# EAGLE design DigiPC Jr (EAGLE 7.2.0)
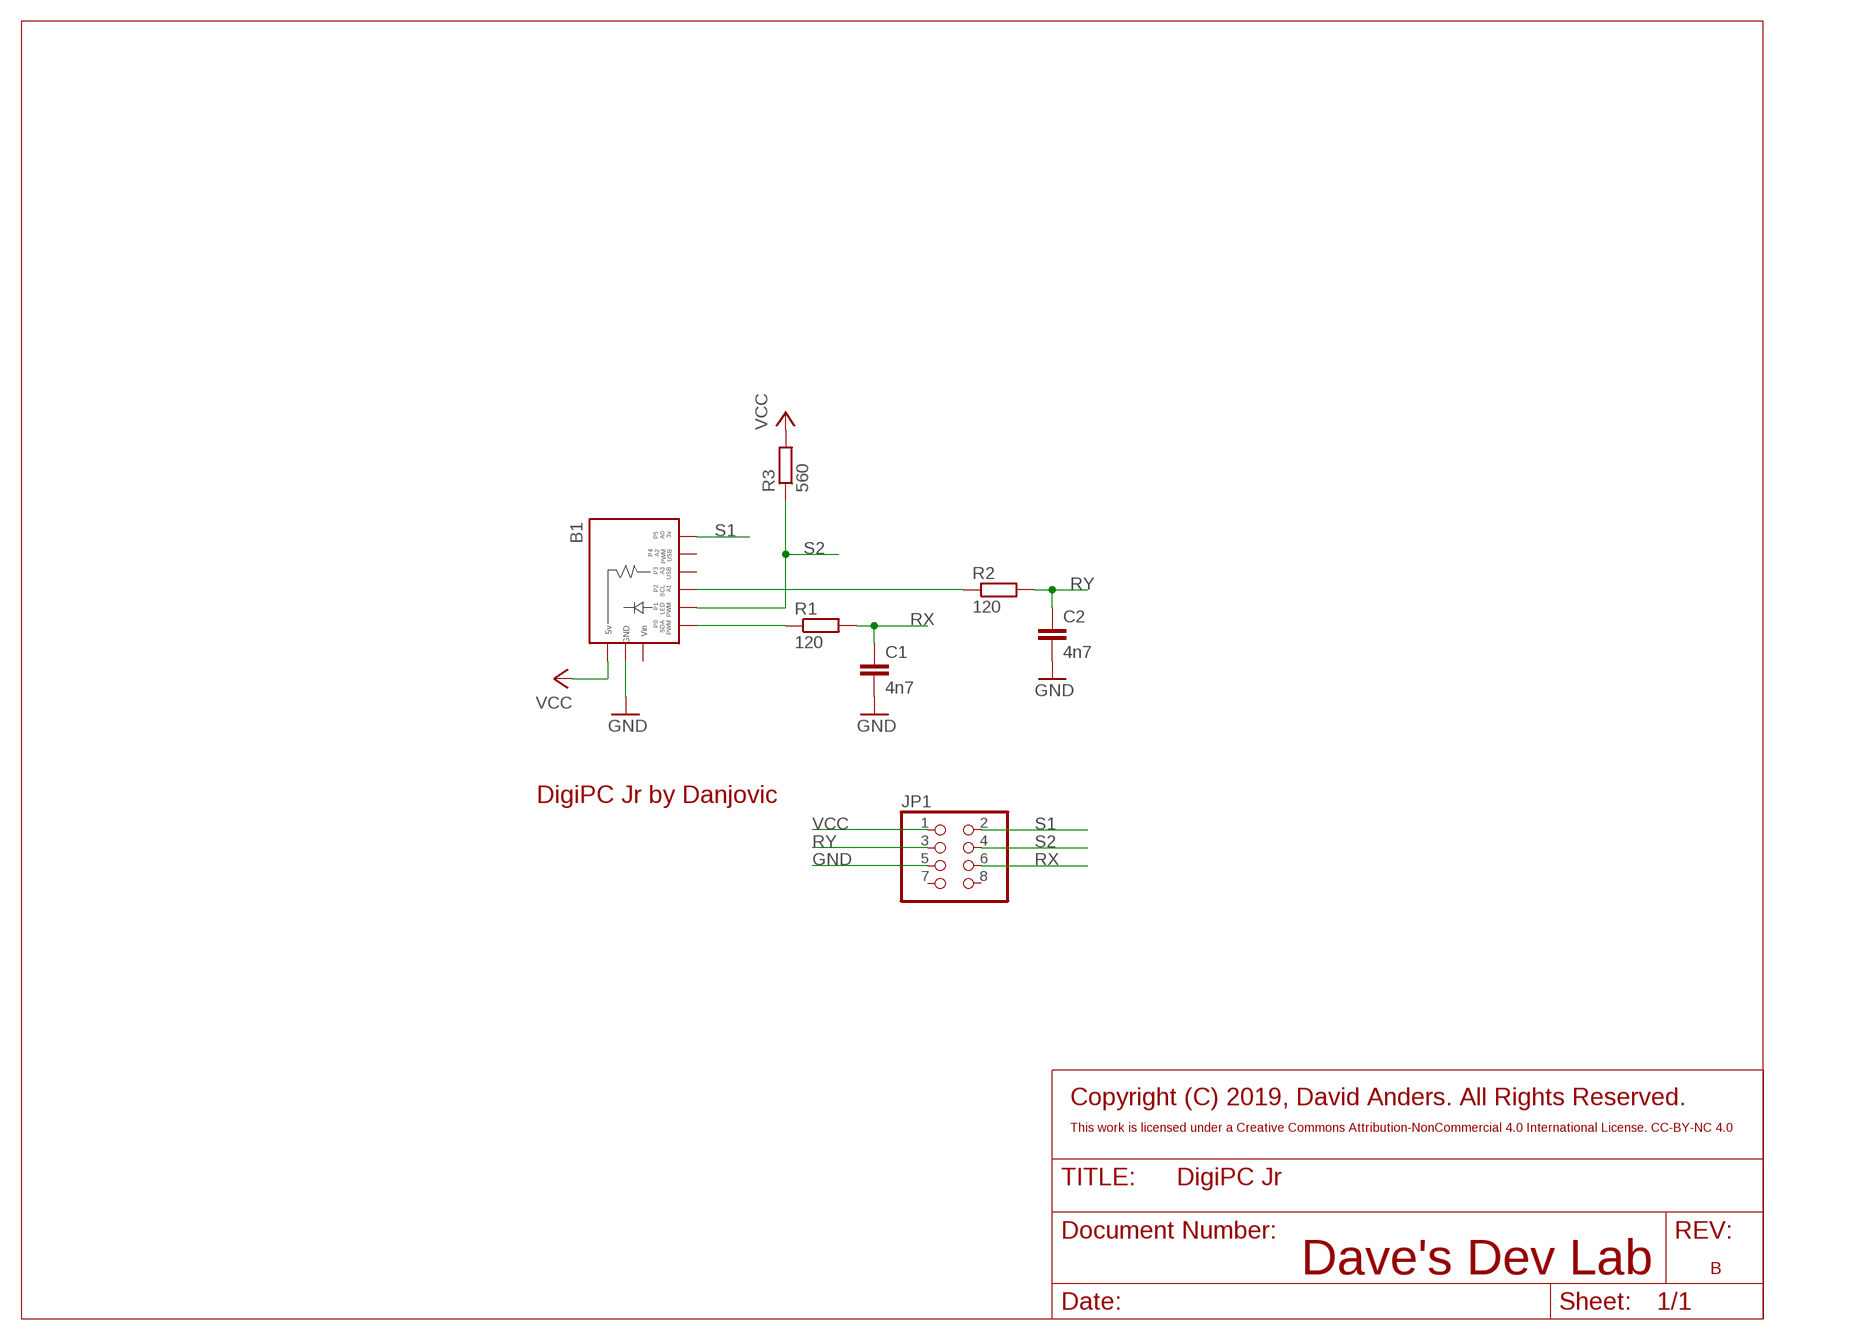
[diagram p0: schematic, sheet 1]

## Parts
B1  DIGISPARK-SOCKET  [DIGISPARK_SOCKET]
C1  4n7  C-EU050-024X044  [C050-024X044]
C2  4n7  C-EU050-024X044  [C050-024X044]
JP1  PINHD-2X4/90  [2X04/90]
R1  120  R-EU_0204/7  [0204/7]
R2  120  R-EU_0204/7  [0204/7]
R3  560  R-EU_0204/7  [0204/7]

## Nets
GND: B1.GND C1.2 C2.2 JP1.5
N$1: B1.P2 R2.1
N$2: B1.P0 R1.1
RX: C1.1 JP1.6 R1.2
RY: C2.1 JP1.3 R2.2
S1: B1.P5 JP1.2
S2: B1.P1 JP1.4 R3.1
VCC: B1.5V JP1.1 R3.2
Unconnected: B1.P3 B1.P4 JP1.7 JP1.8

## Notes on the sheet
- DigiPC Jr by Danjovic
- Copyright (C) 2019, David Anders. All Rights Reserved.
- This work is licensed under a Creative Commons Attribution-NonCommercial 4.0 International License. CC-BY-NC 4.0
- Dave's Dev Lab | B

## Power pins joined to a net without a drawn wire
VIN: B1.VIN

## Library data of the parts
B1 = Digistump:DIGISPARK: Digispark http://digistump.com/wiki/digispark
C1 C2 = rcl:C-EU: CAPACITOR, European symbol
JP1 = custom-pinhead:PINHD-2X4: PIN HEADER
R1-R3 = rcl:R-EU_: RESISTOR, European symbol

## Board
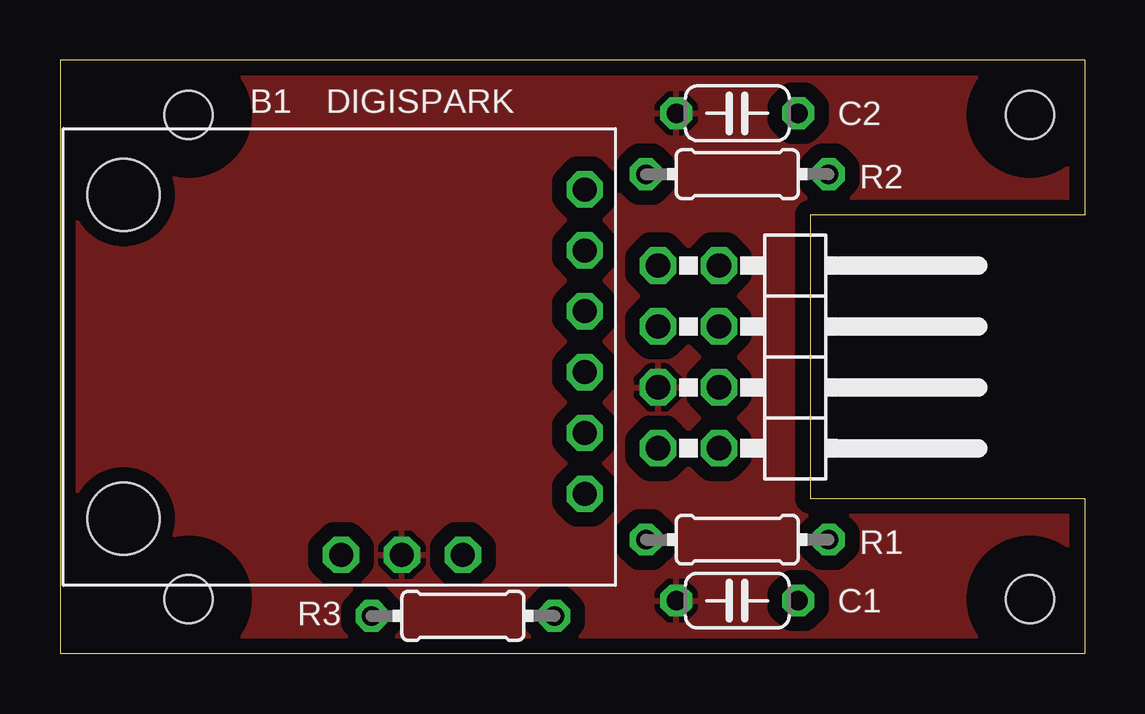
[diagram p1: board, top side]
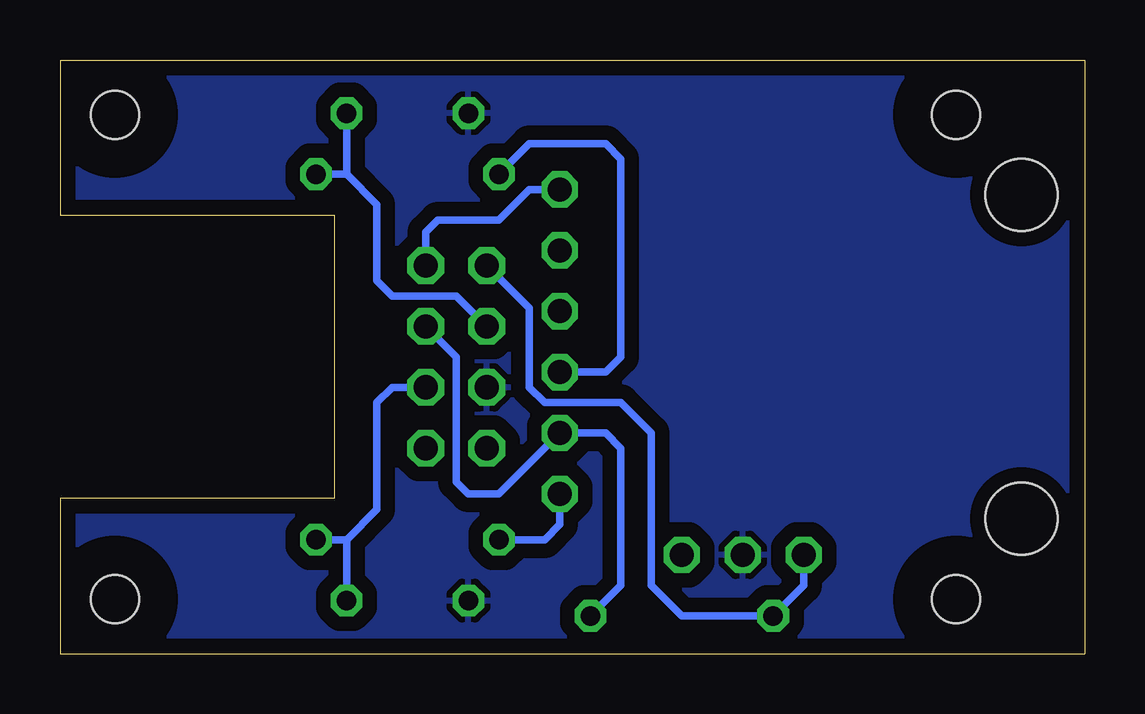
[diagram p2: board, bottom side, seen from below]

Size 42.7 x 24.77 mm. Coordinates in mm from the lower left corner, seen from the top.
Outline: 42.7,24.77 0,24.77 0,0 42.7,0 42.7,6.48 31.27,6.48 31.27,18.29 42.7,18.29 42.7,24.77
Copper layers (1*16): Top 0.035mm / dielectric 1.5mm / Bottom 0.035mm
Design rules "default *": minimum track width 8mil, minimum drill 12mil, track to track 8mil, track to pad 8mil, pad to pad 8mil, via to via 8mil, smd to smd 8mil, copper to edge 25mil, drill to drill 8mil, minimum pad ring 10mil, minimum via ring 8mil, stop-mask expansion 4mil, vias tented up to drill 0mil, thermal gap 10mil
Holes 2.01 mm at 40.41,22.48 5.36,22.48 40.41,2.29 5.36,2.29
tRestrict: area 38.4,20.5 to 42.4,24.5; area 3.4,20.5 to 7.4,24.5; area 38.4,0.3 to 42.4,4.3; area 3.4,0.3 to 7.4,4.3
bRestrict: area 38.4,20.5 to 42.4,24.5; area 3.4,20.5 to 7.4,24.5; area 38.4,0.3 to 42.4,4.3; area 3.4,0.3 to 7.4,4.3

### Footprints (pad centres in the part's own frame; a part is rotated, then mirrored left to right if it is on the bottom)
DIGISPARK_SOCKET = drill 1 octagon: 5V 17.78,-11.43; GND 17.78,-8.89; P0 15.24,-1.27; P1 12.7,-1.27; P2 10.16,-1.27; P3 7.62,-1.27; P4 5.08,-1.27; P5 2.54,-1.27; VIN 17.78,-6.35 | hole 3: 2.775,-20.5; 16.275,-20.5
C050-024X044 = drill 0.813 octagon: 1 -2.54,0; 2 2.54,0
2X04/90 = drill 1.016 octagon: 1 -3.81,-6.35; 2 -3.81,-3.81; 3 -1.27,-6.35; 4 -1.27,-3.81; 5 1.27,-6.35; 6 1.27,-3.81; 7 3.81,-6.35; 8 3.81,-3.81
0204/7 = drill 0.813 octagon: 1 -3.81,0; 2 3.81,0

### Placement (x,y rotation side)
B1  23.14,21.91 270 top
C1  28.22,2.22 180 top
C2  28.22,22.54 180 top
JP1  31.27,12.38 270 top
R1  28.22,4.76 0 top
R2  28.22,20 0 top
R3  16.79,1.59 180 top

### Tracks (layer width: path | path; a pad name or v marks a point on that pad's centre or on a via)
GND
  pour Bottom (isolate 0.61): 42.7,24.77 42.7,18.29 31.27,18.29 31.27,6.48 42.7,6.48 42.7,0 0.03,0 0.03,24.77
  pour Top (isolate 0.61): 42.7,24.77 42.7,18.29 31.27,18.29 31.27,6.48 42.7,6.48 42.7,0 0.03,0 0.03,24.77
N$1
  Bottom 0.305: R2.1 23.14,21.27 19.96,21.27 19.33,20.64 19.33,12.38 19.96,11.75 B1.P2
N$2
  Bottom 0.305: B1.P0 21.87,5.4 22.5,4.76 R1.1
RX
  Bottom 0.305: R1.2 30.76,4.76 | 30.76,4.76 C1.1 | JP1.6 28.85,11.11 29.49,10.48 29.49,6.03 30.76,4.76
RY
  Bottom 0.305: JP1.3 26.19,14.92 28.85,14.92 29.49,15.56 29.49,18.73 30.76,20 | 30.76,20 C2.1 | R2.2 30.76,20
S1
  Bottom 0.305: B1.P5 23.14,19.37 24.41,18.1 26.95,18.1 27.46,17.59 JP1.2
S2
  Bottom 0.305: JP1.4 26.19,12.38 26.19,7.18 25.68,6.67 24.41,6.67 B1.P1 19.96,9.21 19.33,8.57 19.33,2.86 R3.1
VCC
  Bottom 0.305: B1.5V 11.71,2.86 R3.2 16.79,1.59 18.06,2.86 18.06,9.21 19.33,10.48 22.5,10.48 23.14,11.11 23.14,14.41 JP1.1

### Text on the board
tPlace: DIGISPARK
Document: GND | SW2 | SW1 | Y-AXIS | X-AXIS | VCC